# Altium schematic sheet 2-DDR2.SchDoc
size A3; DocumentNumber: 2; SheetNumber: 2; SheetTotal: 7
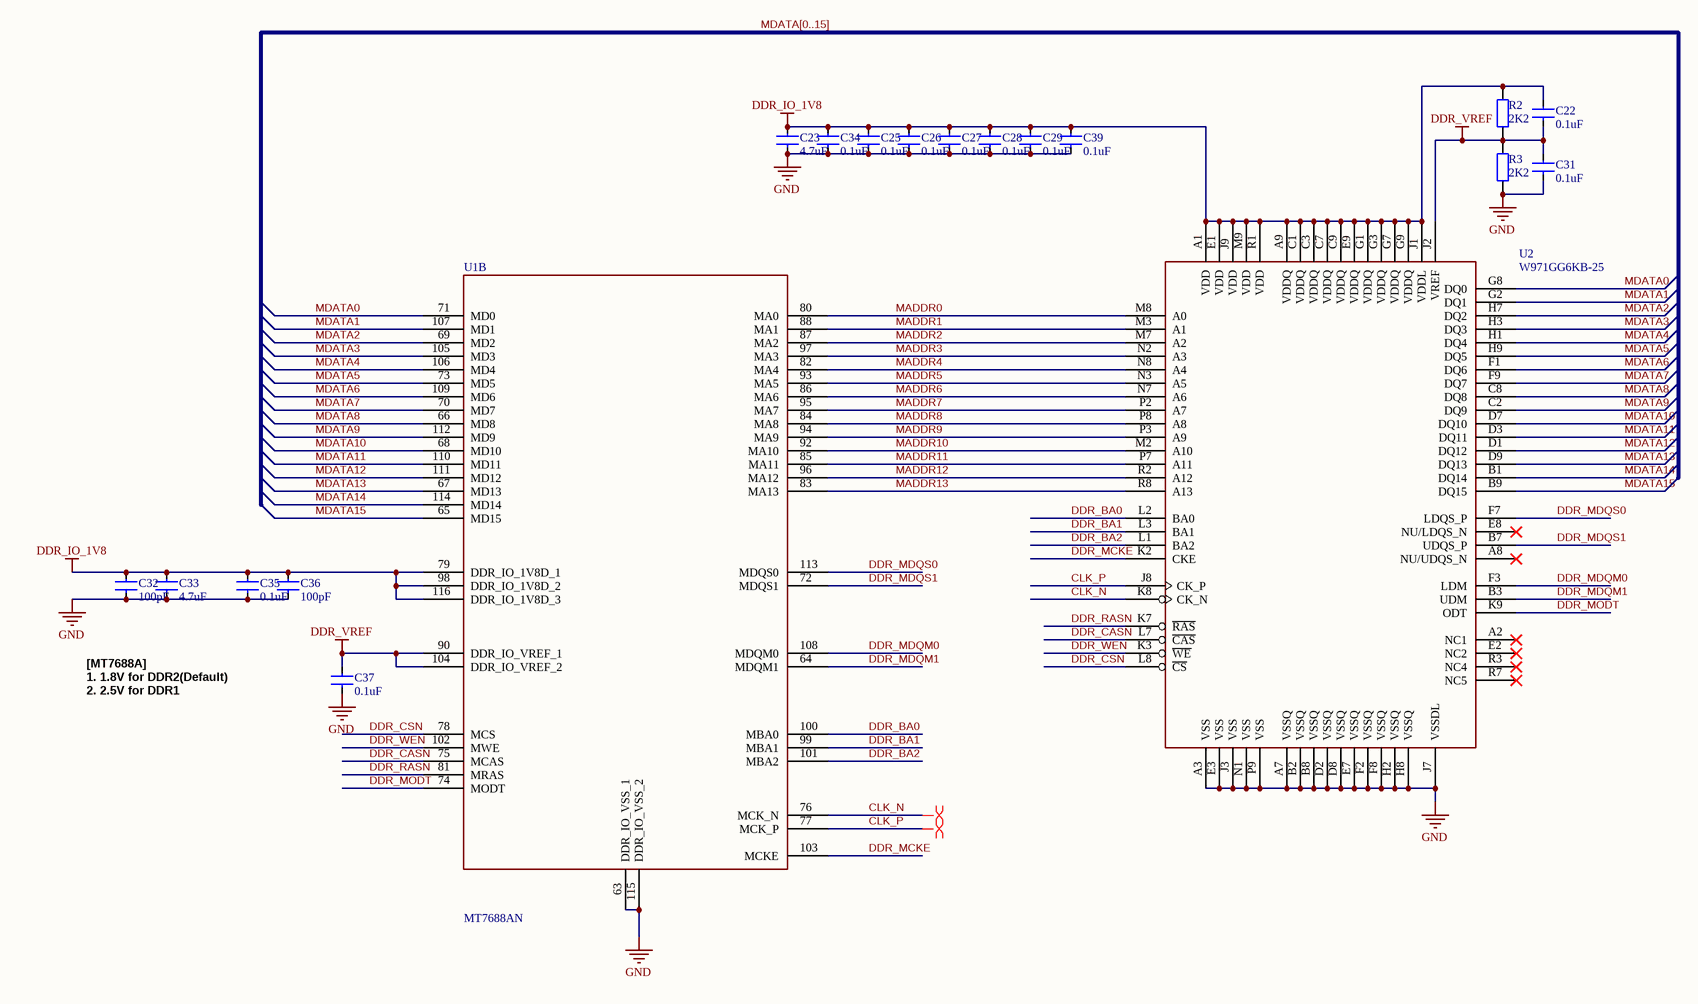
[diagram p0: 2-DDR2.SchDoc]

## Parts
C22  0.1uF  [C0402]
C23  4.7uF  [C0402]
C25  0.1uF  [C0402]
C26  0.1uF  [C0402]
C27  0.1uF  [C0402]
C28  0.1uF  [C0402]
C29  0.1uF  [C0402]
C31  0.1uF  [C0402]
C32  100pF  [C0402]
C33  4.7uF  [C0402]
C34  0.1uF  [C0402]
C35  0.1uF  [C0402]
C36  100pF  [C0402]
C37  0.1uF  [C0402]
C39  0.1uF  [C0402]
R2  2K2  [R0402]
R3  2K2  [R0402]
U1  MT7688AN  [MT7628AN/DRQFN156/SMD/P0.5/12X12]  (part B of 6)
U2  W971GG6KB-25  [FBGA84-small]

## Nets
DDR_IO_1V8: C22.1 C23.1 C25.1 C26.1 C27.1 C28.1 C29.1 C32.1 C33.1 C34.1 C35.1 C36.1 C39.1 R2.2 U1.79(DDR_IO_1V8D_1) U1.98(DDR_IO_1V8D_2) U1.116(DDR_IO_1V8D_3) U2.A1(VDD) U2.A9(VDDQ) U2.C1(VDDQ) U2.C3(VDDQ) U2.C7(VDDQ) U2.C9(VDDQ) U2.E1(VDD) U2.E9(VDDQ) U2.G1(VDDQ) U2.G3(VDDQ) U2.G7(VDDQ) U2.G9(VDDQ) U2.J1(VDDL) U2.J9(VDD) U2.M9(VDD) U2.R1(VDD)
DDR_VREF: C22.2 C31.1 C37.1 R2.1 R3.2 U1.90(DDR_IO_VREF_1) U1.104(DDR_IO_VREF_2) U2.J2(VREF)
GND: C23.2 C25.2 C26.2 C27.2 C28.2 C29.2 C31.2 C32.2 C33.2 C34.2 C35.2 C36.2 C37.2 C39.2 R3.1 U1.63(DDR_IO_VSS_1) U1.115(DDR_IO_VSS_2) U2.A3(VSS) U2.A7(VSSQ) U2.B2(VSSQ) U2.B8(VSSQ) U2.D2(VSSQ) U2.D8(VSSQ) U2.E3(VSS) U2.E7(VSSQ) U2.F2(VSSQ) U2.F8(VSSQ) U2.H2(VSSQ) U2.H8(VSSQ) U2.J3(VSS) U2.J7(VSSDL) U2.N1(VSS) U2.P9(VSS)
CLK_N: U1.76(MCK_N) U2.K8(CK_N)
CLK_P: U1.77(MCK_P) U2.J8(CK_P)
DDR_BA0: U1.100(MBA0) U2.L2(BA0)
DDR_BA1: U1.99(MBA1) U2.L3(BA1)
DDR_BA2: U1.101(MBA2) U2.L1(BA2)
DDR_CASN: U1.75(MCAS) U2.L7(~{CAS})
DDR_CSN: U1.78(MCS) U2.L8(~{CS})
DDR_MCKE: U1.103(MCKE) U2.K2(CKE)
DDR_MDQM0: U1.108(MDQM0) U2.F3(LDM)
DDR_MDQM1: U1.64(MDQM1) U2.B3(UDM)
DDR_MDQS0: U1.113(MDQS0) U2.F7(LDQS_P)
DDR_MDQS1: U1.72(MDQS1) U2.B7(UDQS_P)
DDR_MODT: U1.74(MODT) U2.K9(ODT)
DDR_RASN: U1.81(MRAS) U2.K7(~{RAS})
DDR_WEN: U1.102(MWE) U2.K3(~{WE})
MADDR0: U1.80(MA0) U2.M8(A0)
MADDR1: U1.88(MA1) U2.M3(A1)
MADDR2: U1.87(MA2) U2.M7(A2)
MADDR3: U1.97(MA3) U2.N2(A3)
MADDR4: U1.82(MA4) U2.N8(A4)
MADDR5: U1.93(MA5) U2.N3(A5)
MADDR6: U1.86(MA6) U2.N7(A6)
MADDR7: U1.95(MA7) U2.P2(A7)
MADDR8: U1.84(MA8) U2.P8(A8)
MADDR9: U1.94(MA9) U2.P3(A9)
MADDR10: U1.92(MA10) U2.M2(A10)
MADDR11: U1.85(MA11) U2.P7(A11)
MADDR12: U1.96(MA12) U2.R2(A12)
MADDR13: U1.83(MA13) U2.R8(A13)
MDATA0: U1.71(MD0) U2.G8(DQ0)
MDATA1: U1.107(MD1) U2.G2(DQ1)
MDATA2: U1.69(MD2) U2.H7(DQ2)
MDATA3: U1.105(MD3) U2.H3(DQ3)
MDATA4: U1.106(MD4) U2.H1(DQ4)
MDATA5: U1.73(MD5) U2.H9(DQ5)
MDATA6: U1.109(MD6) U2.F1(DQ6)
MDATA7: U1.70(MD7) U2.F9(DQ7)
MDATA8: U1.66(MD8) U2.C8(DQ8)
MDATA9: U1.112(MD9) U2.C2(DQ9)
MDATA10: U1.68(MD10) U2.D7(DQ10)
MDATA11: U1.110(MD11) U2.D3(DQ11)
MDATA12: U1.111(MD12) U2.D1(DQ12)
MDATA13: U1.67(MD13) U2.D9(DQ13)
MDATA14: U1.114(MD14) U2.B1(DQ14)
MDATA15: U1.65(MD15) U2.B9(DQ15)

Not connected (* = marked no-connect by the designer): U2 A2(NC1)* A8(NU/UDQS_N)* E2(NC2)* E8(NU/LDQS_N)* R3(NC4)* R7(NC5)*

## Buses and harness runs
bus MDATA[0..15]

## Layout directives
differential pair: CLK_N, CLK_P

## Notes on the sheet
- [MT7688A]
  1. 1.8V for DDR2(Default)
  2. 2.5V for DDR1

## Library data of the parts
C22 C23 C25-C29 C31-C37 C39 = CAP: 普通小电容
R2 R3 = RES: 普通电阻
U2 = DDR2_x16_512Gb_2Gb: 128MB DDR2 Winbond